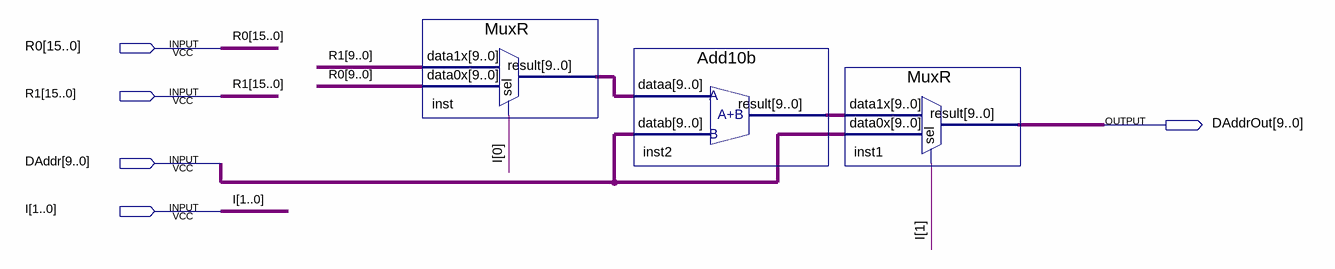
[diagram p0: schematic sheet]
// Quartus schematic IndexManager.bdf as structural Verilog: 3 symbols, 5 pins
module IndexManager (
  input  [15:0] R0,
  input  [15:0] R1,
  input  [9:0] DAddr,
  input  [1:0] I,
  output [9:0] DAddrOut
);

  wire [9:0] inst2_result, inst_result;

  MuxR inst (.data1x(R1[9:0]), .data0x(R0[9:0]), .sel(I[0]), .result(inst_result));
  Add10b inst2 (.dataa(inst_result), .datab(DAddr), .result(inst2_result));
  MuxR inst1 (.data1x(inst2_result), .data0x(DAddr), .sel(I[1]), .result(DAddrOut));
endmodule
